# Altium schematic sheet Fri3D_IRA_02.SchDoc: Top Level
size A3; Date: 25/03/2024; DrawnBy: Wim Van Gool; DocumentNumber: 1; Revision: 02; SheetNumber: 1; SheetTotal: 4
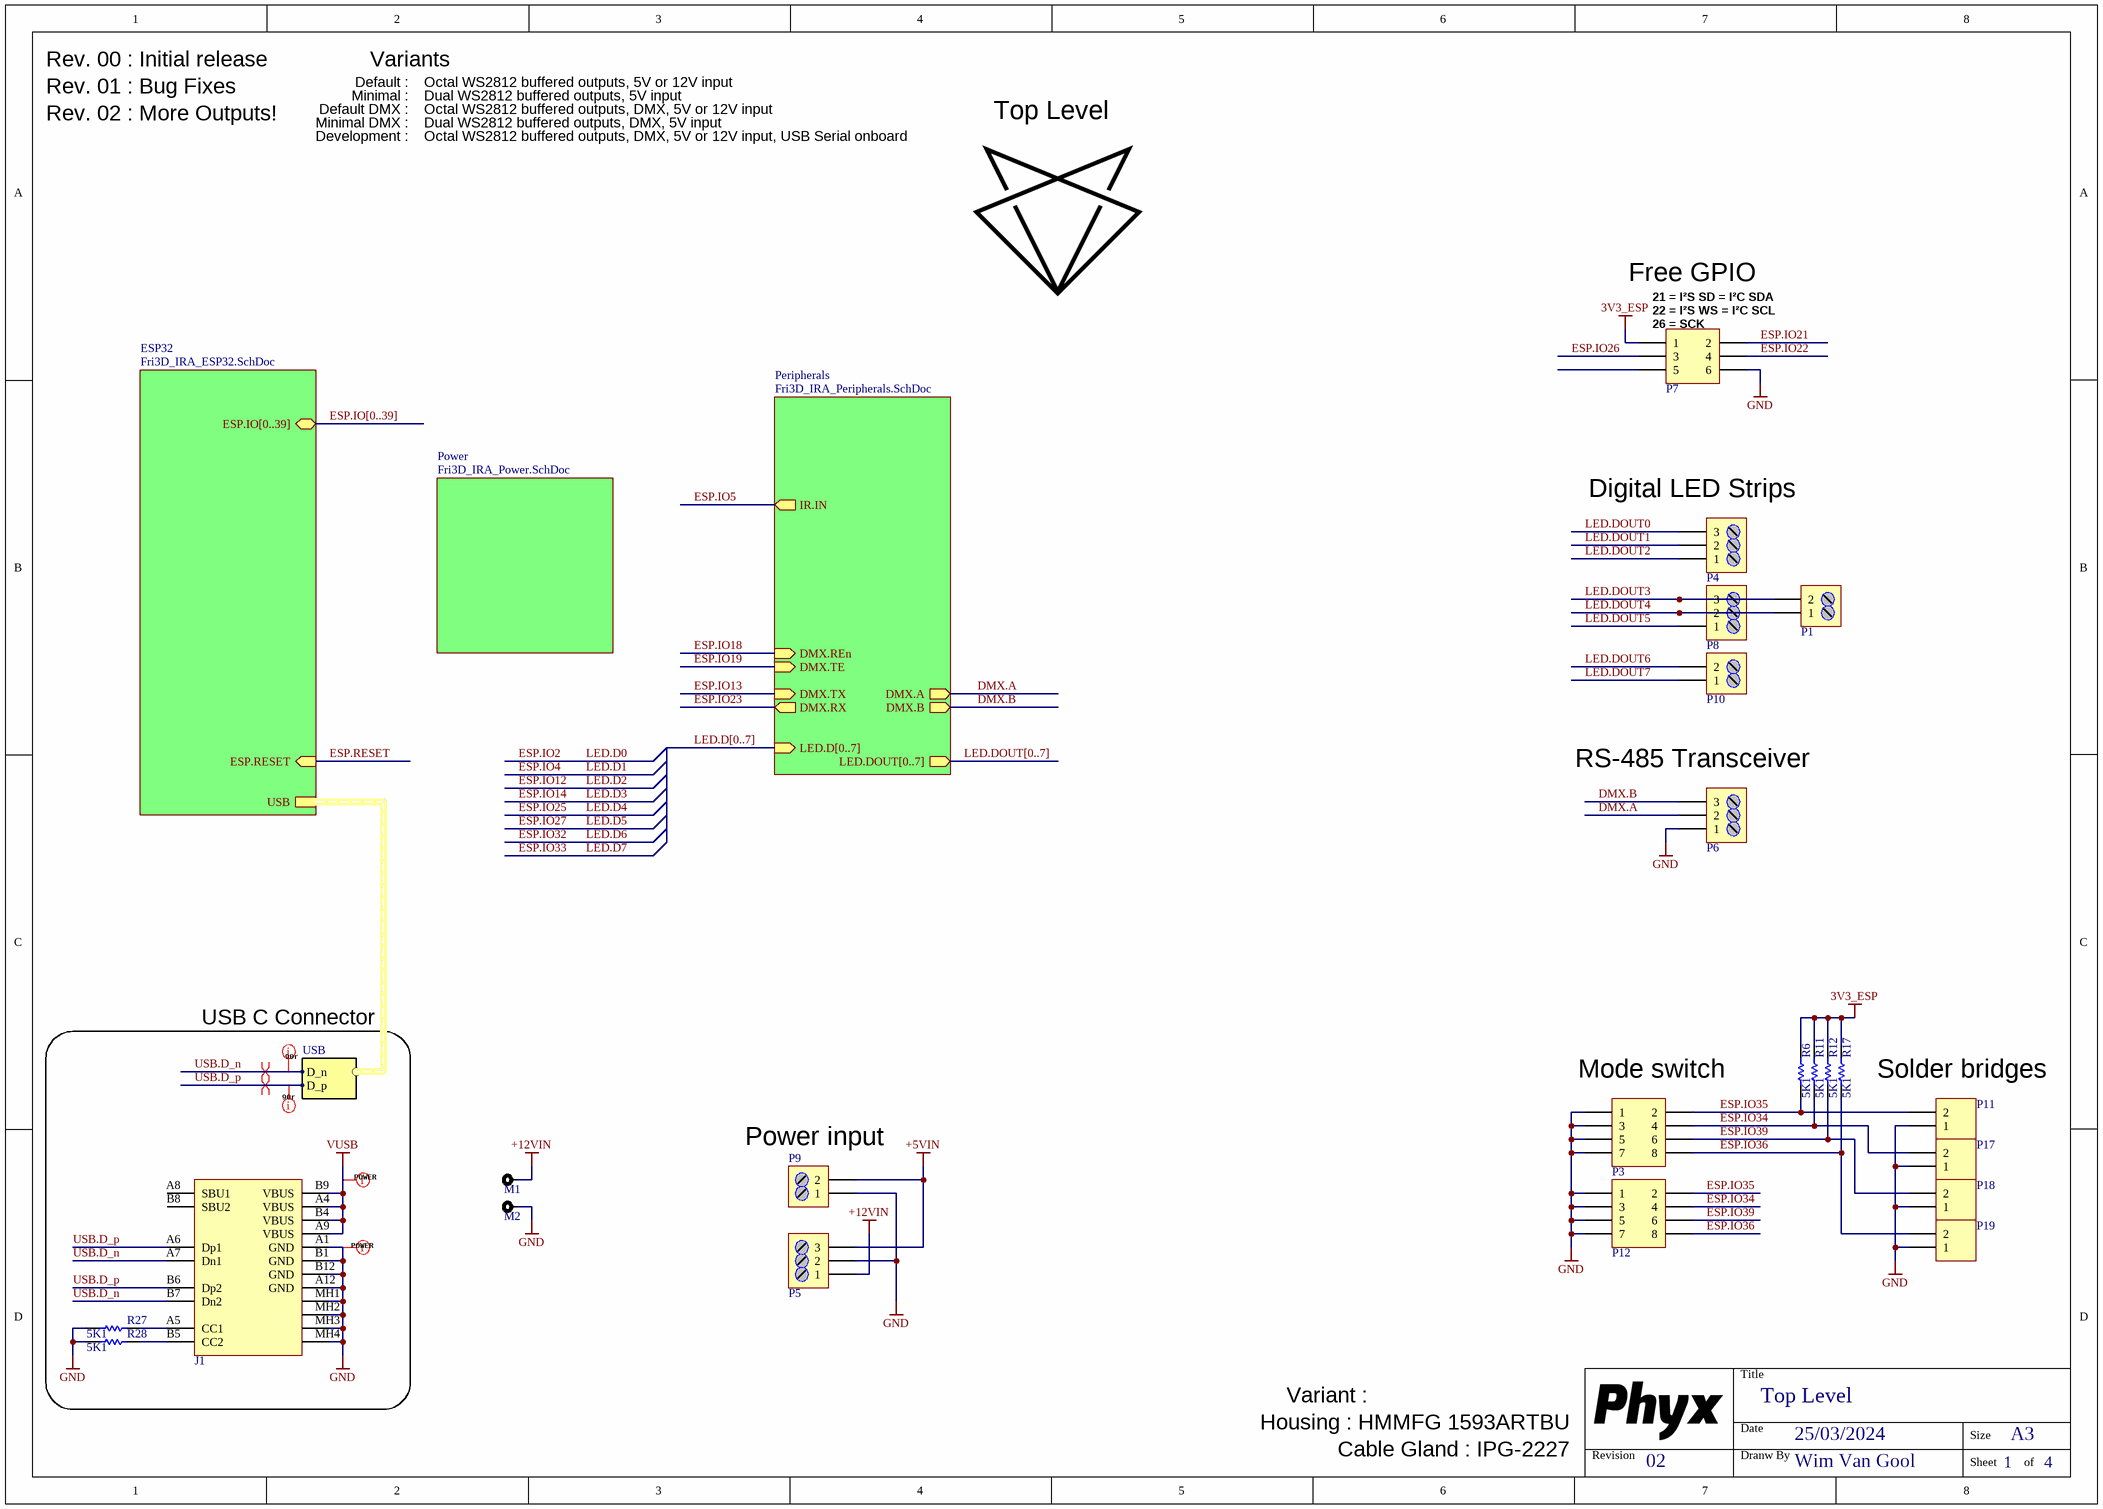
[diagram p0: Fri3D_IRA_02.SchDoc]

## Parts
J1  USB 2.0 C Reversible Receptacle Horizontal  [HRO_TYPE-C-31-M-12]  (value not drawn)
M1  SMD Spacer 1mm M3 Internal Thread  [WE_9774010360]  (value not drawn)
M2  SMD Spacer 1mm M3 Internal Thread  [WE_9774010360]  (value not drawn)
P1  2 Way Screw HDR 3.5mm Rising Cage  [WE_691103110002]  (value not drawn)
P3  Header 4x2  [HDR2X4]  (value not drawn)
P4  3 Way Screw HDR 3.5mm Rising Cage  [WE_691103110003]  (value not drawn)
P5  3 Way Screw HDR 5,08mm  [TERM_BLK-0508-3-90]  (value not drawn)
P6  3 Way Screw HDR 3.5mm Rising Cage  [WE_691103110003]  (value not drawn)
P7  Header 3X2  [HDR2X3]  (value not drawn)
P8  3 Way Screw HDR 3.5mm Rising Cage  [WE_691103110003]  (value not drawn)
P9  2 Way Screw HDR 5,08mm  [TERM_BLK-0508-2-90]  (value not drawn)
P10  2 Way Screw HDR 3.5mm Rising Cage  [WE_691103110002]  (value not drawn)
P11  Easy to solder connection  [SOLDER_SW_V_1MM]  (value not drawn)
P12  Header 4X2  [HDR2X4_SMD]  (value not drawn)
P17  Easy to solder connection  [SOLDER_SW_V_1MM]  (value not drawn)
P18  Easy to solder connection  [SOLDER_SW_V_1MM]  (value not drawn)
P19  Easy to solder connection  [SOLDER_SW_V_1MM]  (value not drawn)
R6  value 5K1  [R0603_N]
R11  value 5K1  [R0603_N]
R12  value 5K1  [R0603_N]
R17  value 5K1  [R0603_N]
R27  value 5K1  [R0603_N]
R28  value 5K1  [R0603_N]

## Blocks framed on the sheet
USB C Connector: J1 R27 R28

## Sub-sheets
ESP32 = Fri3D_IRA_ESP32.SchDoc: ESP.RESET (in), ESP.IO[0..39] (bidir), USB (harness USB)
Peripherals = Fri3D_IRA_Peripherals.SchDoc: IR.IN (out), DMX.RX (out), DMX.A (out), DMX.B (out), DMX.TX (in), DMX.REn (in), DMX.TE (in), LED.D[0..7] (in), LED.DOUT[0..7] (out)
Power = Fri3D_IRA_Power.SchDoc: no entries

## Harnesses
USB: D_p, D_n

## Nets
3V3_ESP: P7.1 R6.1 R11.1 R12.1 R17.1
+5VIN: P5.3 P9.2
+12VIN: M1.1 P5.1
GND: J1.A1(GND) J1.A12(GND) J1.B1(GND) J1.B12(GND) J1.MH1(Tab) J1.MH2(Tab) J1.MH3(Tab) J1.MH4(Tab) M2.1 P3.1 P3.3 P3.5 P3.7 P5.2 P6.1 P7.6 P9.1 P11.1 P12.1 P12.3 P12.5 P12.7 P17.1 P18.1 P19.1 R27.2 R28.2
VUSB: J1.A4(VBUS) J1.A9(VBUS) J1.B4(VBUS) J1.B9(VBUS)
DMX.A: P6.2 ; sheet Peripherals/DMX.A
DMX.B: P6.3 ; sheet Peripherals/DMX.B
ESP.IO5: sheet Peripherals/IR.IN
ESP.IO13: sheet Peripherals/DMX.TX
ESP.IO18: sheet Peripherals/DMX.REn
ESP.IO19: sheet Peripherals/DMX.TE
ESP.IO21: P7.2
ESP.IO22: P7.4
ESP.IO23: sheet Peripherals/DMX.RX
ESP.IO26: P7.3
ESP.IO34: P3.4 P12.4 P17.2 R11.2
ESP.IO35: P3.2 P11.2 P12.2 R6.2
ESP.IO36: P3.8 P12.8 P19.2 R17.2
ESP.IO39: P3.6 P12.6 P18.2 R12.2
ESP.RESET: sheet ESP32/ESP.RESET
LED.DOUT0: P4.3
LED.DOUT1: P4.2
LED.DOUT2: P4.1
LED.DOUT3: P1.2 P8.3
LED.DOUT4: P1.1 P8.2
LED.DOUT5: P8.1
LED.DOUT6: P10.2
LED.DOUT7: P10.1
USB.D_n: J1.A7(Dn1) J1.B7(Dn2) ; sheet ESP32/USB.D_n
USB.D_p: J1.A6(Dp1) J1.B6(Dp2) ; sheet ESP32/USB.D_p
NetJ1_A5: J1.A5(CC1) R27.1
NetJ1_B5: J1.B5(CC2) R28.1

Not connected (* = marked no-connect by the designer): J1 A8(SBU1) B8(SBU2); P7 5

## Buses and harness runs
bus ESP.IO[0..39] = sheet ESP32/ESP.IO[0..39]
bus LED.D[0..7] = sheet Peripherals/LED.D[0..7]
bus LED.DOUT[0..7] = sheet Peripherals/LED.DOUT[0..7]

## Layout directives
net class 90r: USB.D_n, USB.D_p
differential pair: USB.D_n, USB.D_p
net class POWER: GND, VUSB

## Notes on the sheet
- Rev. 00 : Initial release
- Variants
- Rev. 01 : Bug Fixes
- Rev. 02 : More Outputs!
- Default :
- Minimal :
- Minimal DMX :
- Default DMX :
- Octal WS2812 buffered outputs, 5V or 12V input
- Dual WS2812 buffered outputs, 5V input
- Dual WS2812 buffered outputs, DMX, 5V input
- Octal WS2812 buffered outputs, DMX, 5V or 12V input
- Development :
- Octal WS2812 buffered outputs, DMX, 5V or 12V input, USB Serial onboard
- (near P7) 22 = I²S WS = I²C SCL
- (near P7) 26 = SCK
- (near P7) 21 = I²S SD = I²C SDA
- Free GPIO
- (near P4) Digital LED Strips
- (near P6) RS-485 Transceiver
- (near P3) Mode switch
- Solder bridges
- (near P9) Power input
- Variant :
- Housing : HMMFG 1593ARTBU
- Cable Gland : IPG-2227
- Title
- Revision
- Date
- Dranw By
- Size
- A3
- Sheet
- of

## Library data of the parts
J1 = USB # C 2.0 RCPT TYPE-C-31-M-12: Value: TYPE-C-31-M-12; Supplier 1: China; Supplier Part Number 1: HRO TYPE-C-31-M-12; Supplier 2: LCSC; Supplier Part Number 2: C165948; Supplier 3: LCSC ALT; Supplier Part Number 3: C167321 / C319148
M1 M2 = SPACER # M3 1mm: Screw Hole; Value: 9774010360; Supplier 1: Wurth; Supplier Part Number 1: 9774010360
P1 P10 = Terminal Block 3.5mm 2way: Supplier 1: LCSC; Supplier Part Number 1: C784940; Supplier 2: Würth; Supplier Part Number 2: 691214110002
P3 = Pin Header 2.54mm dual row 8way
P4 P6 P8 = Terminal Block 3.5mm 3way: Supplier 1: LCSC; Supplier Part Number 1: C784941; Supplier 2: Würth; Supplier Part Number 2: 691214110003
P5 = Terminal Block 5.08mm 3way: Value: PM5.08/3/90; Supplier 1: Farnell
P7 = Pin Header 2.54mm dual row 6way
P9 = Terminal Block 5.08mm 2way: Value: PM5.08/2/90; Supplier 1: Farnell; Supplier Part Number 1: 1131853; Supplier 2: LCSC; Supplier Part Number 2: C8465
P11 P17-P19 = SOLDER SW V 1MM: Value: NO BOM
P12 = Pin Header # 2.54mm dual row 8way: Supplier 1: LCSC; Supplier Part Number 1: C192300; Description: Pin Header # 2.54mm dual row 8way
R6 R11 R12 R17 R27 R28 = RES # 5K1 0603: Supplier 1: Farnell; Supplier Part Number 1: 2845922; Supplier 2: LCSC; Supplier 3: Generic; Supplier Part Number 2: C112314; Supplier Part Number 3: 5K1 1% 0603